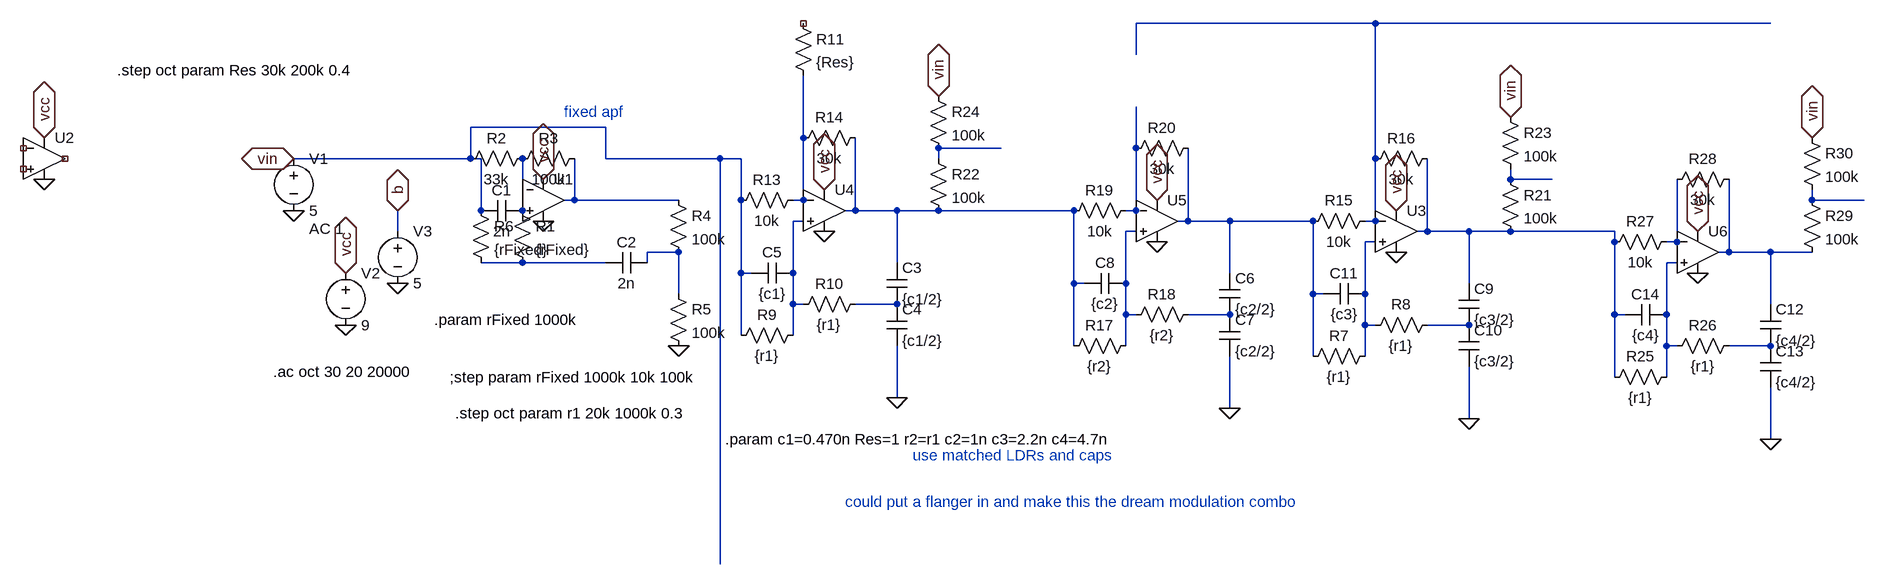
[diagram p0: schematic LDR_Phaser.asc]
LDR_Phaser.asc, the LTspice schematic file:
Version 4
SHEET 1 2260 1220
WIRE 1504 -128 1136 -128
WIRE 2112 -128 1504 -128
WIRE 1136 -80 1136 -128
WIRE 320 32 112 32
WIRE 624 48 624 -48
WIRE 928 64 832 64
WIRE 1136 64 1136 0
WIRE 112 80 112 32
WIRE 112 80 -160 80
WIRE 128 80 112 80
WIRE 320 80 320 32
WIRE 496 80 320 80
WIRE 528 80 496 80
WIRE 832 80 832 64
WIRE 1504 80 1504 -128
WIRE 1712 112 1712 96
WIRE 1776 112 1712 112
WIRE 192 128 192 80
WIRE 272 144 272 80
WIRE 272 144 256 144
WIRE 432 144 272 144
WIRE 528 144 528 80
WIRE 624 144 624 48
WIRE 624 144 608 144
WIRE 2176 144 2176 128
WIRE 2256 144 2176 144
WIRE 128 160 128 80
WIRE 704 160 704 48
WIRE 704 160 688 160
WIRE 768 160 704 160
WIRE 832 160 768 160
WIRE 1040 160 832 160
WIRE 1136 160 1136 64
WIRE 1136 160 1120 160
WIRE 624 176 608 176
WIRE 1216 176 1216 64
WIRE 1216 176 1200 176
WIRE 1280 176 1216 176
WIRE 1408 176 1280 176
WIRE 1504 176 1504 80
WIRE 1504 176 1488 176
WIRE 0 192 0 160
WIRE 1136 192 1120 192
WIRE 1584 192 1584 80
WIRE 1584 192 1568 192
WIRE 1648 192 1584 192
WIRE 1712 192 1648 192
WIRE 1872 192 1712 192
WIRE 1504 208 1488 208
WIRE 1872 208 1872 192
WIRE 1968 208 1968 112
WIRE 1968 208 1952 208
WIRE 432 224 384 224
WIRE 2048 224 2048 112
WIRE 2048 224 2032 224
WIRE 2112 224 2048 224
WIRE 2176 224 2112 224
WIRE 192 240 128 240
WIRE 320 240 192 240
WIRE 384 240 384 224
WIRE 768 240 768 160
WIRE 1968 240 1952 240
WIRE 528 256 528 144
WIRE 544 256 528 256
WIRE 608 256 608 176
WIRE 1280 256 1280 176
WIRE 1040 272 1040 160
WIRE 1056 272 1040 272
WIRE 1120 272 1120 192
WIRE 1648 272 1648 192
WIRE 432 288 432 224
WIRE 1408 288 1408 176
WIRE 1424 288 1408 288
WIRE 1488 288 1488 208
WIRE 608 304 608 256
WIRE 624 304 608 304
WIRE 768 304 704 304
WIRE 2112 304 2112 224
WIRE 1120 320 1120 272
WIRE 1136 320 1120 320
WIRE 1280 320 1216 320
WIRE 1872 320 1872 208
WIRE 1888 320 1872 320
WIRE 1952 320 1952 240
WIRE 1488 336 1488 288
WIRE 1504 336 1488 336
WIRE 1648 336 1584 336
WIRE 528 352 528 256
WIRE 608 352 608 304
WIRE 1040 368 1040 272
WIRE 1120 368 1120 320
WIRE 1952 368 1952 320
WIRE 1968 368 1952 368
WIRE 2112 368 2048 368
WIRE 1408 384 1408 288
WIRE 1488 384 1488 336
WIRE 1872 416 1872 320
WIRE 1952 416 1952 368
WIRE 768 448 768 368
WIRE 1280 464 1280 384
WIRE 1648 480 1648 400
WIRE 2112 512 2112 432
WIRE 496 704 496 80
FLAG -80 336 0
FLAG -160 160 0
FLAG -80 256 vcc
IOPIN -80 256 BiDir
FLAG 0 272 0
FLAG 0 160 b
IOPIN 0 160 BiDir
FLAG 224 112 vcc
IOPIN 224 112 BiDir
FLAG 224 176 0
FLAG -544 48 vcc
IOPIN -544 48 BiDir
FLAG -544 112 0
FLAG 656 128 vcc
IOPIN 656 128 BiDir
FLAG 656 192 0
FLAG 768 448 0
FLAG 1168 144 vcc
IOPIN 1168 144 BiDir
FLAG 1168 208 0
FLAG 1280 464 0
FLAG 432 368 0
FLAG -160 80 vin
IOPIN -160 80 BiDir
FLAG 832 -16 vin
IOPIN 832 -16 BiDir
FLAG 1536 160 vcc
IOPIN 1536 160 BiDir
FLAG 1536 224 0
FLAG 1648 480 0
FLAG 1712 16 vin
IOPIN 1712 16 BiDir
FLAG 2000 192 vcc
IOPIN 2000 192 BiDir
FLAG 2000 256 0
FLAG 2112 512 0
FLAG 2176 48 vin
IOPIN 2176 48 BiDir
SYMBOL voltage -160 64 R0
WINDOW 123 24 124 Left 2
WINDOW 39 0 0 Left 0
SYMATTR Value2 AC 1
SYMATTR InstName V1
SYMATTR Value 5
SYMBOL voltage -80 240 R0
WINDOW 123 0 0 Left 0
WINDOW 39 0 0 Left 0
SYMATTR InstName V2
SYMATTR Value 9
SYMBOL voltage 0 176 R0
WINDOW 123 0 0 Left 0
WINDOW 39 0 0 Left 0
SYMATTR InstName V3
SYMATTR Value 5
SYMBOL Opamps\\UniversalOpamp2 224 144 R0
SYMATTR InstName U1
SYMBOL Opamps\\UniversalOpamp2 -544 80 R0
SYMATTR InstName U2
SYMBOL res 176 144 R0
SYMATTR InstName R1
SYMATTR Value {rFixed}
SYMBOL cap 192 144 R90
WINDOW 0 0 32 VBottom 2
WINDOW 3 32 32 VTop 2
SYMATTR InstName C1
SYMATTR Value 2n
SYMBOL res 208 64 R90
WINDOW 0 0 56 VBottom 2
WINDOW 3 32 56 VTop 2
SYMATTR InstName R2
SYMATTR Value 33k
SYMBOL res 288 64 R90
WINDOW 0 0 56 VBottom 2
WINDOW 3 32 56 VTop 2
SYMATTR InstName R3
SYMATTR Value 100k
SYMBOL Opamps\\UniversalOpamp2 656 160 R0
SYMATTR InstName U4
SYMBOL cap 752 240 R0
SYMATTR InstName C3
SYMATTR Value {c1/2}
SYMBOL cap 752 304 R0
SYMATTR InstName C4
SYMATTR Value {c1/2}
SYMBOL cap 608 240 R90
WINDOW 0 0 32 VBottom 2
WINDOW 3 32 32 VTop 2
SYMATTR InstName C5
SYMATTR Value {c1}
SYMBOL res 624 336 R90
WINDOW 0 0 56 VBottom 2
WINDOW 3 32 56 VTop 2
SYMATTR InstName R9
SYMATTR Value {r1}
SYMATTR SpiceLine tol=10
SYMBOL res 720 288 R90
WINDOW 0 0 56 VBottom 2
WINDOW 3 32 56 VTop 2
SYMATTR InstName R10
SYMATTR Value {r1}
SYMATTR SpiceLine tol=10
SYMBOL res 624 128 R90
WINDOW 0 0 56 VBottom 2
WINDOW 3 32 56 VTop 2
SYMATTR InstName R13
SYMATTR Value 10k
SYMBOL res 720 32 R90
WINDOW 0 0 56 VBottom 2
WINDOW 3 32 56 VTop 2
SYMATTR InstName R14
SYMATTR Value 30k
SYMBOL Opamps\\UniversalOpamp2 1168 176 R0
SYMATTR InstName U5
SYMBOL cap 1264 256 R0
SYMATTR InstName C6
SYMATTR Value {c2/2}
SYMBOL cap 1264 320 R0
SYMATTR InstName C7
SYMATTR Value {c2/2}
SYMBOL cap 1120 256 R90
WINDOW 0 0 32 VBottom 2
WINDOW 3 32 32 VTop 2
SYMATTR InstName C8
SYMATTR Value {c2}
SYMBOL res 1136 352 R90
WINDOW 0 0 56 VBottom 2
WINDOW 3 32 56 VTop 2
SYMATTR InstName R17
SYMATTR Value {r2}
SYMBOL res 1232 304 R90
WINDOW 0 0 56 VBottom 2
WINDOW 3 32 56 VTop 2
SYMATTR InstName R18
SYMATTR Value {r2}
SYMBOL res 1136 144 R90
WINDOW 0 0 56 VBottom 2
WINDOW 3 32 56 VTop 2
SYMATTR InstName R19
SYMATTR Value 10k
SYMBOL res 1232 48 R90
WINDOW 0 0 56 VBottom 2
WINDOW 3 32 56 VTop 2
SYMATTR InstName R20
SYMATTR Value 30k
SYMBOL res 416 128 R0
SYMATTR InstName R4
SYMATTR Value 100k
SYMBOL res 416 272 R0
SYMATTR InstName R5
SYMATTR Value 100k
SYMBOL cap 384 224 R90
WINDOW 0 0 32 VBottom 2
WINDOW 3 32 32 VTop 2
SYMATTR InstName C2
SYMATTR Value 2n
SYMBOL res 112 144 R0
SYMATTR InstName R6
SYMATTR Value {rFixed}
SYMBOL res 816 64 R0
SYMATTR InstName R22
SYMATTR Value 100k
SYMBOL res 816 -32 R0
SYMATTR InstName R24
SYMATTR Value 100k
SYMBOL Opamps\\UniversalOpamp2 1536 192 R0
SYMATTR InstName U3
SYMBOL cap 1632 272 R0
SYMATTR InstName C9
SYMATTR Value {c3/2}
SYMBOL cap 1632 336 R0
SYMATTR InstName C10
SYMATTR Value {c3/2}
SYMBOL cap 1488 272 R90
WINDOW 0 0 32 VBottom 2
WINDOW 3 32 32 VTop 2
SYMATTR InstName C11
SYMATTR Value {c3}
SYMBOL res 1504 368 R90
WINDOW 0 0 56 VBottom 2
WINDOW 3 32 56 VTop 2
SYMATTR InstName R7
SYMATTR Value {r1}
SYMBOL res 1600 320 R90
WINDOW 0 0 56 VBottom 2
WINDOW 3 32 56 VTop 2
SYMATTR InstName R8
SYMATTR Value {r1}
SYMBOL res 1504 160 R90
WINDOW 0 0 56 VBottom 2
WINDOW 3 32 56 VTop 2
SYMATTR InstName R15
SYMATTR Value 10k
SYMBOL res 1600 64 R90
WINDOW 0 0 56 VBottom 2
WINDOW 3 32 56 VTop 2
SYMATTR InstName R16
SYMATTR Value 30k
SYMBOL res 1696 96 R0
SYMATTR InstName R21
SYMATTR Value 100k
SYMBOL res 1696 0 R0
SYMATTR InstName R23
SYMATTR Value 100k
SYMBOL Opamps\\UniversalOpamp2 2000 224 R0
SYMATTR InstName U6
SYMBOL cap 2096 304 R0
SYMATTR InstName C12
SYMATTR Value {c4/2}
SYMBOL cap 2096 368 R0
SYMATTR InstName C13
SYMATTR Value {c4/2}
SYMBOL cap 1952 304 R90
WINDOW 0 0 32 VBottom 2
WINDOW 3 32 32 VTop 2
SYMATTR InstName C14
SYMATTR Value {c4}
SYMBOL res 1968 400 R90
WINDOW 0 0 56 VBottom 2
WINDOW 3 32 56 VTop 2
SYMATTR InstName R25
SYMATTR Value {r1}
SYMBOL res 2064 352 R90
WINDOW 0 0 56 VBottom 2
WINDOW 3 32 56 VTop 2
SYMATTR InstName R26
SYMATTR Value {r1}
SYMBOL res 1968 192 R90
WINDOW 0 0 56 VBottom 2
WINDOW 3 32 56 VTop 2
SYMATTR InstName R27
SYMATTR Value 10k
SYMBOL res 2064 96 R90
WINDOW 0 0 56 VBottom 2
WINDOW 3 32 56 VTop 2
SYMATTR InstName R28
SYMATTR Value 30k
SYMBOL res 2160 128 R0
SYMATTR InstName R29
SYMATTR Value 100k
SYMBOL res 2160 32 R0
SYMATTR InstName R30
SYMATTR Value 100k
SYMBOL res 608 -144 R0
SYMATTR InstName R11
SYMATTR Value {Res}
TEXT -192 408 Left 2 !.ac oct 30 20 20000
TEXT 256 8 Left 2 ;fixed apf
TEXT 504 512 Left 2 !.param c1=0.470n Res=1 r2=r1 c2=1n c3=2.2n c4=4.7n
TEXT 88 472 Left 2 !.step oct param r1 20k 1000k 0.3
TEXT 80 416 Left 2 !;step param rFixed 1000k 10k 100k
TEXT 792 536 Left 2 ;use matched LDRs and caps
TEXT -432 -56 Left 2 !.step oct param Res 30k 200k 0.4
TEXT 56 328 Left 2 !.param rFixed 1000k
TEXT 688 608 Left 2 ;could put a flanger in and make this the dream modulation combo

The netlist it stands for:
* LDR_Phaser.asc
V1 vin 0 5 AC 1
V2 vcc 0 9
V3 b 0 5
XU1 P001 N006 vcc 0 N007 level.2 Avol=1Meg GBW=10Meg Slew=10Meg ilimit=25m rail=0 Vos=0 phimargin=45 en=0 enk=0 in=0 ink=0 Rin=500Meg  ; pins IN+ IN- V+ V- OUT
XU2 NC_01 NC_02 vcc 0 NC_03 level.2 Avol=1Meg GBW=10Meg Slew=10Meg ilimit=25m rail=0 Vos=0 phimargin=45 en=0 enk=0 in=0 ink=0 Rin=500Meg  ; pins IN+ IN- V+ V- OUT
R1 P001 N018 {rFixed}
C1 P001 vin 2n
R2 N006 vin 33k
R3 N007 N006 100k
XU4 N010 N002 vcc 0 N009 level.2 Avol=1Meg GBW=10Meg Slew=10Meg ilimit=25m rail=0 Vos=0 phimargin=45 en=0 enk=0 in=0 ink=0 Rin=500Meg  ; pins IN+ IN- V+ V- OUT
C3 N009 N020 {c1/2}
C4 N020 0 {c1/2}
C5 N010 vin {c1}
R9 N010 vin {r1} tol=10
R10 N020 N010 {r1} tol=10
R13 N002 vin 10k
R14 N009 N002 30k
XU5 N012 N004 vcc 0 N011 level.2 Avol=1Meg GBW=10Meg Slew=10Meg ilimit=25m rail=0 Vos=0 phimargin=45 en=0 enk=0 in=0 ink=0 Rin=500Meg  ; pins IN+ IN- V+ V- OUT
C6 N011 N021 {c2/2}
C7 N021 0 {c2/2}
C8 N012 N009 {c2}
R17 N012 N009 {r2}
R18 N021 N012 {r2}
R19 N004 N009 10k
R20 N011 N004 30k
R4 N007 N016 100k
R5 N016 0 100k
C2 N016 N018 2n
R6 vin N018 {rFixed}
R22 N003 N009 100k
R24 vin N003 100k
XU3 N014 N001 vcc 0 N013 level.2 Avol=1Meg GBW=10Meg Slew=10Meg ilimit=25m rail=0 Vos=0 phimargin=45 en=0 enk=0 in=0 ink=0 Rin=500Meg  ; pins IN+ IN- V+ V- OUT
C9 N013 N022 {c3/2}
C10 N022 0 {c3/2}
C11 N014 N011 {c3}
R7 N014 N011 {r1}
R8 N022 N014 {r1}
R15 N001 N011 10k
R16 N013 N001 30k
R21 N005 N013 100k
R23 vin N005 100k
XU6 N019 N015 vcc 0 N017 level.2 Avol=1Meg GBW=10Meg Slew=10Meg ilimit=25m rail=0 Vos=0 phimargin=45 en=0 enk=0 in=0 ink=0 Rin=500Meg  ; pins IN+ IN- V+ V- OUT
C12 N017 N023 {c4/2}
C13 N023 0 {c4/2}
C14 N019 N013 {c4}
R25 N019 N013 {r1}
R26 N023 N019 {r1}
R27 N015 N013 10k
R28 N017 N015 30k
R29 N008 N017 100k
R30 vin N008 100k
R11 NC_04 N002 {Res}
.ac oct 30 20 20000
* fixed apf
.param c1=0.470n Res=1 r2=r1 c2=1n c3=2.2n c4=4.7n
.step oct param r1 20k 1000k 0.3
;step param rFixed 1000k 10k 100k
* use matched LDRs and caps
.step oct param Res 30k 200k 0.4
.param rFixed 1000k
* could put a flanger in and make this the dream modulation combo
.lib UniversalOpamps2.sub
.backanno
.end